# Altium schematic sheet Power.SchDoc
size C; Organization: MIT; SheetNumber: 3; SheetTotal: 5; Section: Power
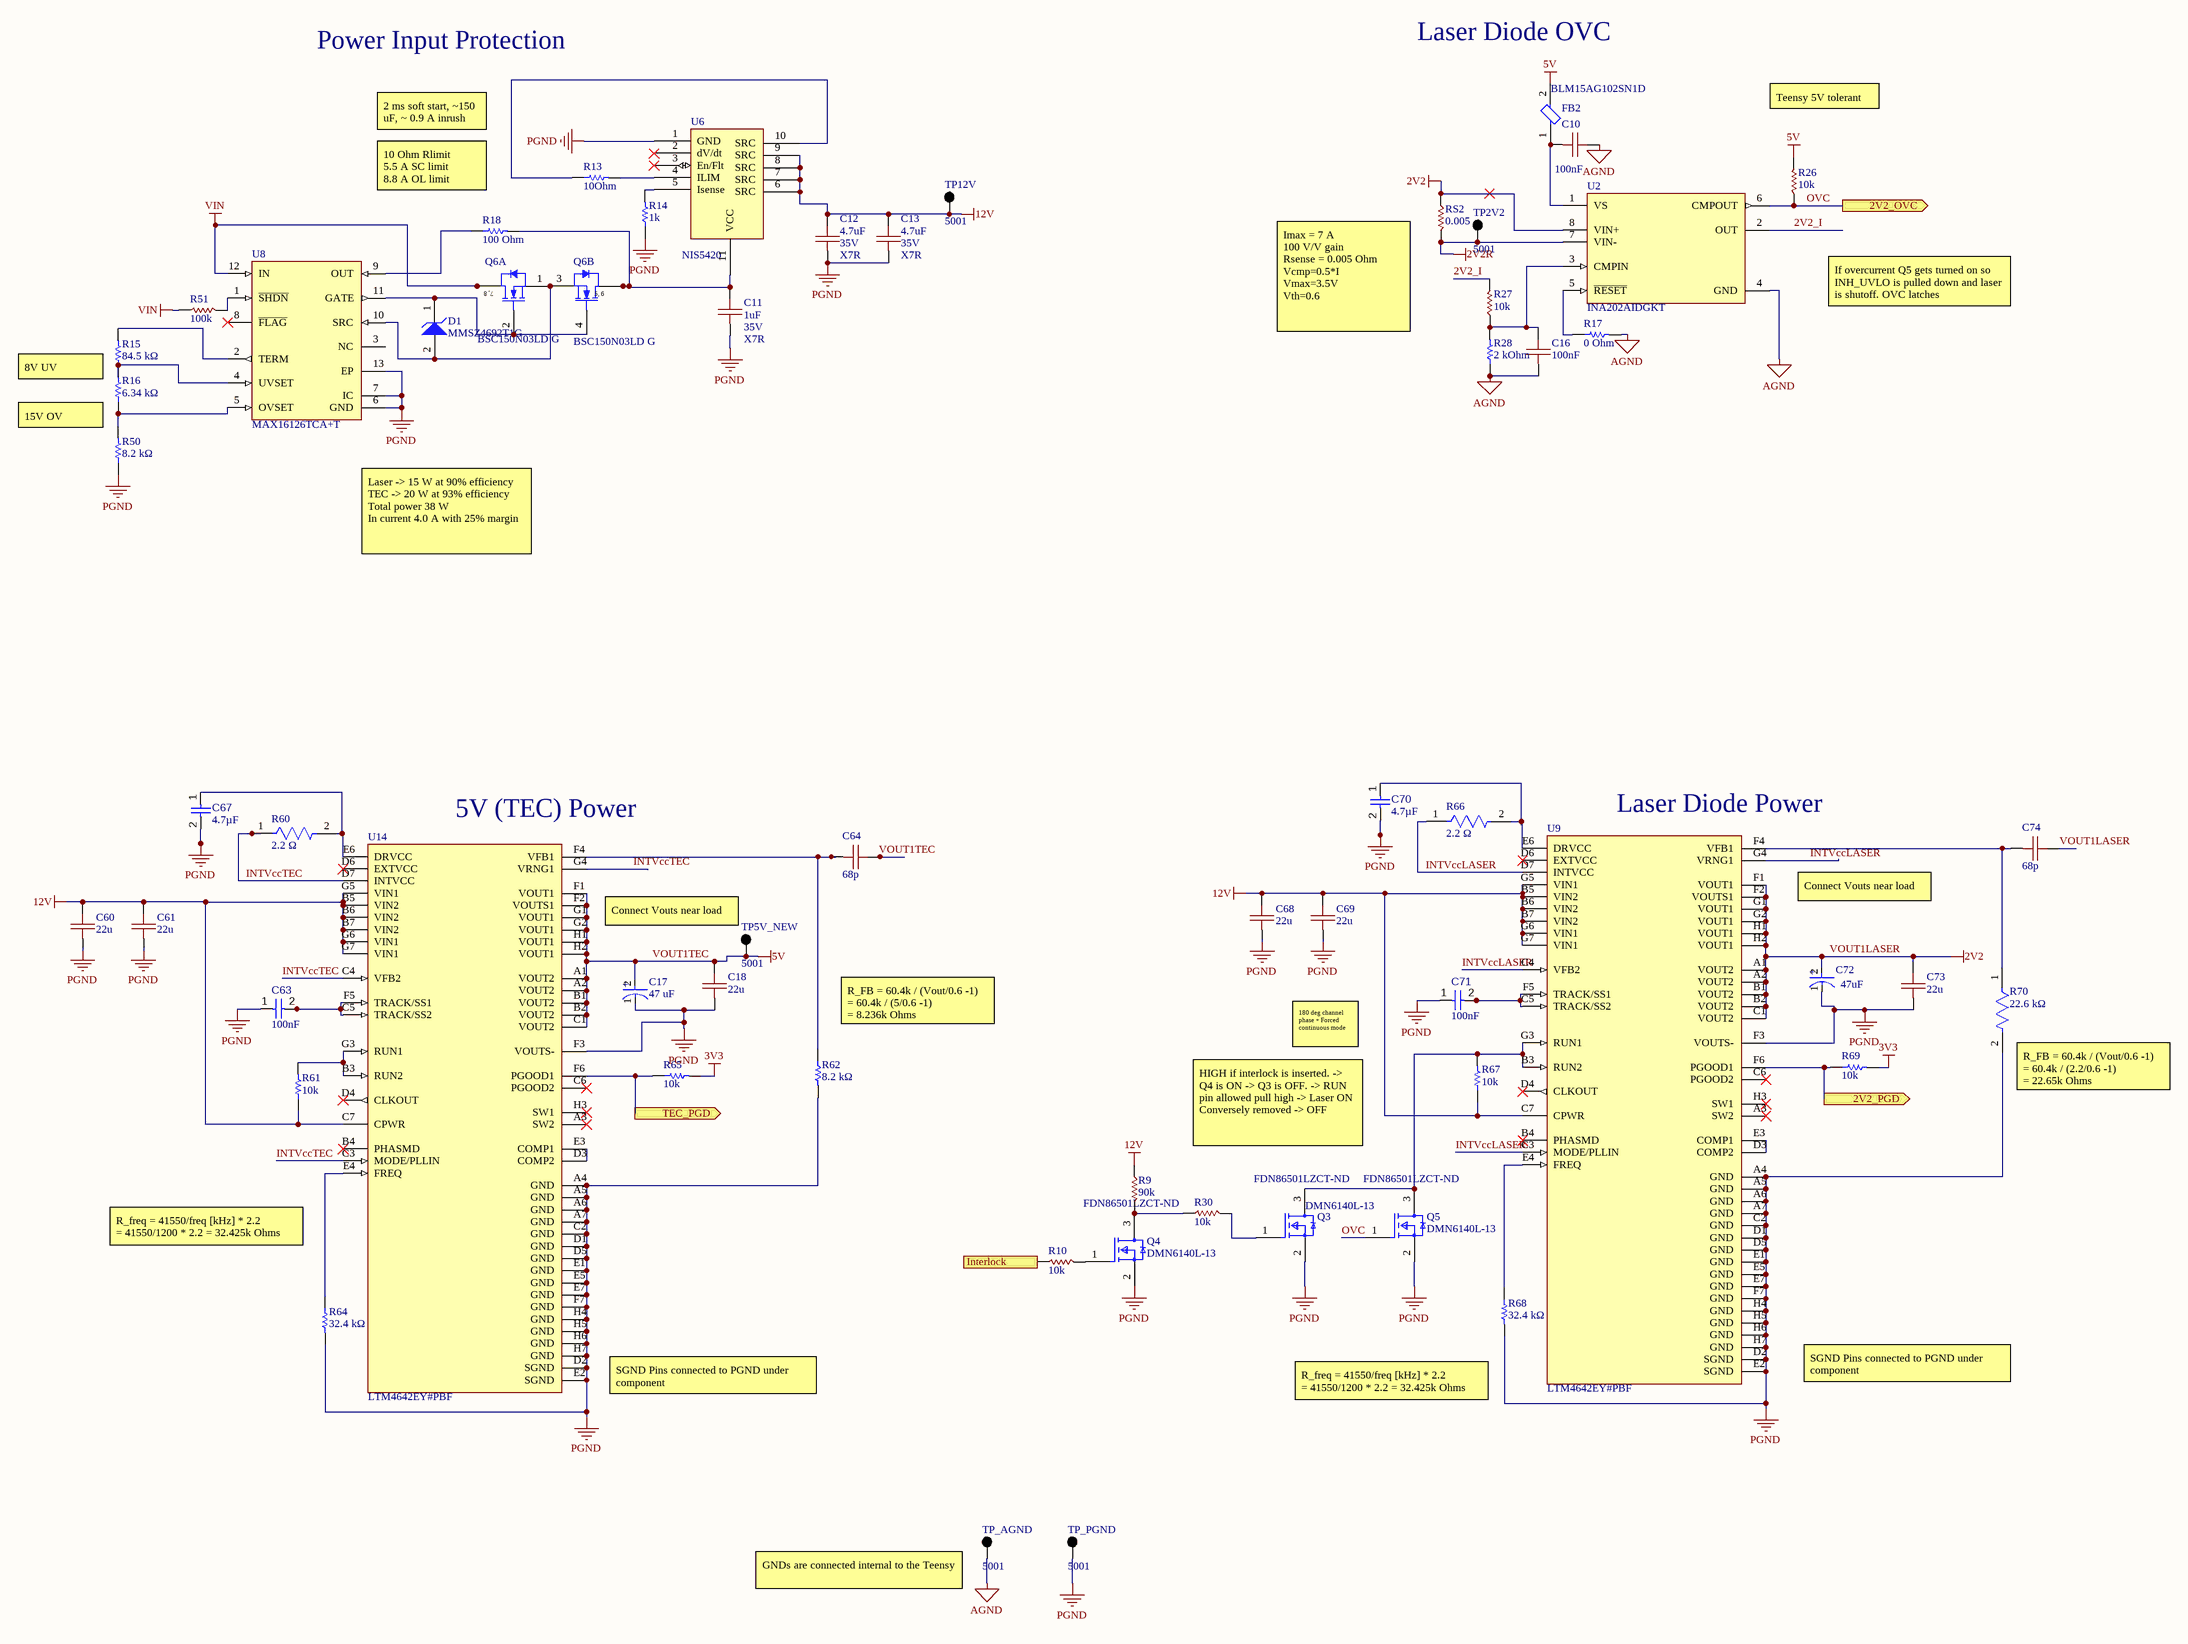
[diagram p0: Power.SchDoc]

## Parts
C10  100nF  [0603 B]
C11  1uF  Voltage: 35V  Type: X7R  [0805 B]
C12  4.7uF  Voltage: 35V  Type: X7R  [0805 B]
C13  4.7uF  Voltage: 35V  Type: X7R  [0805 B]
C16  100nF  [0603 B]
C17  47 uF  [FP-T491D476K025AT-MFG]
C18  22u  [1210]
C60  22u  [1210]
C61  22u  [1210]
C63  value 100nF  [CAPC1005X56X25LL10T15]  (hidden comment: Capacitor 0.1 uF +/- 5% 16 V 0402)
C64  68p  [0805 B]
C67  value 4.7µF  [CAPC0805(2012)145_L]  (hidden comment: Capacitor 4.7µF +/-40% 25V 0805)
C68  22u  [1210]
C69  22u  [1210]
C70  value 4.7µF  [CAPC0805(2012)145_L]  (hidden comment: Capacitor 4.7µF +/-40% 25V 0805)
C71  value 100nF  [CAPC1005X56X25LL10T15]  (hidden comment: Capacitor 0.1 uF +/- 5% 16 V 0402)
C72  Capacitance: 47uF  [FP-T491D476K025AT-MFG]  (hidden comment: 47 uF)
C73  22u  [1210]
C74  68p  [0805 B]
D1  MMSZ4692T1G  [ONSC-SOD-123-2-425-04_V]
FB2  BLM15AG102SN1D  [FP-BLM15-MFG]
Q3  DMN6140L-13  Supplier Part Number 2: FDN86501LZCT-ND  [FP-SOT23-MFG]
Q4  DMN6140L-13  Supplier Part Number 2: FDN86501LZCT-ND  [FP-SOT23-MFG]
Q5  DMN6140L-13  Supplier Part Number 2: FDN86501LZCT-ND  [FP-SOT23-MFG]
Q6  BSC150N03LD G  [INF-PG-TDSON-8-4_V]  (parts A,B of 2)
R9  90k  [0603]
R10  10k  [0603]
R13  10Ohm  [RESC1608X55X25NL10T15]
R14  1k  [RESC1608X55X30LL20T20]
R15  84.5 kΩ  [RESC1609X50X30NL10T20]
R16  6.34 kΩ  [RESC1608X55X30NL15T15]
R17  0 Ohm  [RESC1608X55X25ML10T15]
R18  100 Ohm  [RESC1608X55X30LL15T15]
R26  10k  [0603]
R27  10k  [0805]
R28  2 kOhm  [RESC1608X55X30ML15T15]
R30  10k  [0603]
R50  8.2 kΩ  [RESC1609X50X30NL10T20]
R51  100k  [0603]
R60  2.2 Ω  [FP-CRCW0603-HPe3-IPC_A]
R61  10k  [RESC1608X55X30LL20T20]
R62  8.2 kΩ  [RESC1609X50X30ML10T20]
R64  32.4 kΩ  [RESC1609X50X30LL10T20]
R65  10k  [RESC1608X55X30LL20T20]
R66  2.2 Ω  [FP-CRCW0603-HPe3-IPC_A]
R67  10k  [RESC1608X55X30LL20T20]
R68  32.4 kΩ  [RESC1609X50X30LL10T20]
R69  10k  [RESC1608X55X30LL20T20]
R70  22.6 kΩ  [FP-CRCW0402-e3-IPC_C]
RS2  0.005  [1206]
TP2V2  5001  [KSTN-5001]
TP5V_NEW  5001  [KSTN-5001]
TP12V  5001  [KSTN-5001]
TP_AGND  5001  [KSTN-5001]
TP_PGND  5001  [KSTN-5001]
U2  INA202AIDGKT  [FP-DGK0008A-IPC_A]
U6  NIS5420  [SON50P300X10_HS-11N]
U8  MAX16126TCA+T  [T1233+4_N]
U9  LTM4642EY#PBF  [FP-BGA-56-05-08-1961-MFG]
U14  LTM4642EY#PBF  [FP-BGA-56-05-08-1961-MFG]

## Ports
2V2_OVC (out), 2V2_PGD (out), Interlock (in), TEC_PGD (out)

## Nets
2V2R: RS2.1 TP2V2.1 U2.7(VIN-)
3V3: R65.2 R69.2
12V: C12.2 C13.2 C60.2 C61.2 C68.2 C69.2 R9.2 R61.1 R67.1 TP12V.1 U6.6(SRC) U6.7(SRC) U6.8(SRC) U6.9(SRC) U9.B5(VIN2) U9.B6(VIN2) U9.B7(VIN2) U9.C7(CPWR) U9.G5(VIN1) U9.G6(VIN1) U9.G7(VIN1) U14.B5(VIN2) U14.B6(VIN2) U14.B7(VIN2) U14.C7(CPWR) U14.G5(VIN1) U14.G6(VIN1) U14.G7(VIN1)
AGND: C10.2 C16.1 R17.2 R28.1 TP_AGND.1 U2.4(GND)
PGND: C11.1 C12.1 C13.1 C17.1(C) C18.1 C60.1 C61.1 C63.1 C67.2 C68.1 C69.1 C70.2 C71.1 C72.1(C) C73.1 Q3.2(S) Q4.2(S) Q5.2(S) R14.1 R50.1 R62.2 R64.2 R68.2 R70.2 TP_PGND.1 U6.1(GND) U8.6(GND) U8.7(IC) U8.13(EP) U9.A4(GND) U9.A5(GND) U9.A6(GND) U9.A7(GND) U9.C2(GND) U9.D1(GND) U9.D2(SGND) U9.D5(GND) U9.E1(GND) U9.E2(SGND) U9.E5(GND) U9.E7(GND) U9.F3(VOUTS-) U9.F7(GND) U9.H4(GND) U9.H5(GND) U9.H6(GND) U9.H7(GND) U14.A4(GND) U14.A5(GND) U14.A6(GND) U14.A7(GND) U14.C2(GND) U14.D1(GND) U14.D2(SGND) U14.D5(GND) U14.E1(GND) U14.E2(SGND) U14.E5(GND) U14.E7(GND) U14.F3(VOUTS-) U14.F7(GND) U14.H4(GND) U14.H5(GND) U14.H6(GND) U14.H7(GND)
VIN: Q6.7(D1) Q6.8(D1) R51.2 U8.12(IN)
VOUT1LASER: C72.2(A) C73.2 C74.2 RS2.2 U2.8(VIN+) U9.A1(VOUT2) U9.A2(VOUT2) U9.B1(VOUT2) U9.B2(VOUT2) U9.C1(VOUT2) U9.F1(VOUT1) U9.F2(VOUTS1) U9.G1(VOUT1) U9.G2(VOUT1) U9.H1(VOUT1) U9.H2(VOUT1)  [also labelled 2V2]
VOUT1TEC: C17.2(A) C18.2 C64.2 FB2.2 R26.1 TP5V_NEW.1 U14.A1(VOUT2) U14.A2(VOUT2) U14.B1(VOUT2) U14.B2(VOUT2) U14.C1(VOUT2) U14.F1(VOUT1) U14.F2(VOUTS1) U14.G1(VOUT1) U14.G2(VOUT1) U14.H1(VOUT1) U14.H2(VOUT1)  [also labelled 5V]
2V2_I: R27.1 U2.2(OUT)
2V2_PGD: R69.1 U9.F6(PGOOD1) ; port 2V2_PGD
Interlock: R10.2 ; port Interlock
INTVccLASER: R66.1 U9.C3(MODE/PLLIN) U9.C4(VFB2) U9.D7(INTVCC) U9.G4(VRNG1)
INTVccTEC: R60.1 U14.C3(MODE/PLLIN) U14.C4(VFB2) U14.D7(INTVCC) U14.G4(VRNG1)
OVC: Q5.1(G) R26.2 U2.6(CMPOUT) ; port 2V2_OVC
TEC_PGD: R65.1 U14.F6(PGOOD1) ; port TEC_PGD
NetC10_1: C10.1 FB2.1 U2.1(VS)
NetC11_2: C11.2 Q6.5(D2) Q6.6(D2) R18.2 U6.11(VCC)
NetC16_2: C16.2 R27.2 R28.2 U2.3(CMPIN)
NetC63_2: C63.2 U14.C5(TRACK/SS2) U14.F5(TRACK/SS1)
NetC64_1: C64.1 R62.1 U14.F4(VFB1)
NetC67_1: C67.1 R60.2 U14.E6(DRVCC)
NetC70_1: C70.1 R66.2 U9.E6(DRVCC)
NetC71_2: C71.2 U9.C5(TRACK/SS2) U9.F5(TRACK/SS1)
NetC74_1: C74.1 R70.1 U9.F4(VFB1)
NetD1_1: D1.1(K) Q6.2(G1) Q6.4(G2) U8.11(GATE)
NetD1_2: D1.2(A) Q6.1(S1) Q6.3(S2) U8.10(SRC)
NetQ3_1: Q3.1(G) R30.1
NetQ3_3: Q3.3(D) Q5.3(D) R67.2 U9.B3(RUN2) U9.G3(RUN1)
NetQ4_1: Q4.1(G) R10.1
NetQ4_3: Q4.3(D) R9.1 R30.2
NetR13_1: R13.1 U6.10(SRC)
NetR13_2: R13.2 U6.4(ILIM)
NetR14_2: R14.2 U6.5(Isense)
NetR15_1: R15.1 R16.2 U8.4(UVSET)
NetR15_2: R15.2 U8.2(TERM)
NetR16_1: R16.1 R50.2 U8.5(OVSET)
NetR17_1: R17.1 U2.5(~{RESET})
NetR18_1: R18.1 U8.9(OUT)
NetR51_1: R51.1 U8.1(~{SHDN})
NetR61_2: R61.2 U14.B3(RUN2) U14.G3(RUN1)
NetR64_1: R64.1 U14.E4(FREQ)
NetR68_1: R68.1 U9.E4(FREQ)
NetU9_D3: U9.D3(COMP2) U9.E3(COMP1)
NetU14_D3: U14.D3(COMP2) U14.E3(COMP1)

Not connected (* = marked no-connect by the designer): U6 2(dV/dt)* 3(En/Flt)*; U8 3(NC) 8(~{FLAG})*; U9 A3(SW2)* B4(PHASMD)* C6(PGOOD2)* D4(CLKOUT)* D6(EXTVCC)* H3(SW1)*; U14 A3(SW2)* B4(PHASMD)* C6(PGOOD2)* D4(CLKOUT)* D6(EXTVCC)* H3(SW1)*

## Notes on the sheet
- Power Input Protection
- Laser Diode OVC
- 2 ms soft start, ~150 uF, ~ 0.9 A inrush
- Teensy 5V tolerant
- (near R18) 10 Ohm Rlimit
  5.5 A SC limit
  8.8 A OL limit
- If overcurrent Q5 gets turned on so INH_UVLO is pulled down and laser is shutoff. OVC latches
- (near RS2) Imax = 7 A
  100 V/V gain
  Rsense = 0.005 Ohm
  Vcmp=0.5*I
  Vmax=3.5V
  Vth=0.6
- 15V OV
- 8V UV
- Laser -> 15 W at 90% efficiency
  TEC -> 20 W at 93% efficiency
  Total power 38 W
  In current 4.0 A with 25% margin
- (near U14) 5V (TEC) Power
- (near U9) Laser Diode Power
- Connect Vouts near load
- (near TP5V_NEW) Connect Vouts near load
- (near R62) R_FB = 60.4k / (Vout/0.6 -1)
  = 60.4k / (5/0.6 -1)
  = 8.236k Ohms
- 180 deg channel phase + Forced continuous mode
- (near R70) R_FB = 60.4k / (Vout/0.6 -1)
  = 60.4k / (2.2/0.6 -1)
  = 22.65k Ohms
- HIGH if interlock is inserted. -> Q4 is ON -> Q3 is OFF. -> RUN pin allowed pull high -> Laser ON
  Conversely removed -> OFF
- R_freq = 41550/freq [kHz] * 2.2
  = 41550/1200 * 2.2 = 32.425k Ohms
- (near U14) SGND Pins connected to PGND under component
- SGND Pins connected to PGND under component
- (near TP_AGND) GNDs are connected internal to the Teensy
- Title
- Size
- Date
- File
- C
- Section
- Time
- Sheet
- of
- Revision
- Drawn
- 33-207 / 77 Mass. Ave.
- Cambridge, MA 02139
- (in symbol CMP-1090-00073-1, part A) 7, 8
- (in symbol CMP-1090-00073-1, part B) 5, 6
- (in symbol CMP-03017-000020-1) +

## Library data of the parts
C10 C16 = CAP 0603: 603 Capacitor; Value: 100nF
C11-C13 C64 C74 = CAP 0805: 805 Capacitor
  C11: Value: 1uF
  C12 C13: Value: 4.7uF
  C64 C74: Value: 68p
C17 C72 = CMP-03017-000020-1: CAP TANT 47UF 10% 25V 2917; Manufacturer: KEMET; Manufacturer Part Number: T491D476K025AT; Dielectric Material: Tantalum; Life (Hours): 2000Hour; Ripple Current: 463mA; Leakage Current: 11.8uA; Polarity: Polar; ESR (Equivalent Series Resistance): 700mR; Height - Seated (Max): 0.122inch; Package Quantity: 1; Max Operating Temperature: 125°C; Failure Rate: 0.001%; Height: 2.8mm; Voltage Rating (DC): 25V; Dissipation Factor: 10%; Mount: Surface Mount; Min Operating Temperature: -55°C; Packaging: Tape and Reel; Radiation Hardening: No; Case Code (Metric): 7343; Features: General Purpose; Voltage: 25V; Case/Package: 2917; Case Code (Imperial): 2917; Tolerance: 10%; Number of Pins: 2; Weight: 0.023634oz; REACH SVHC: No SVHC; RoHS Compliant: Yes; Length: 7.3mm; Depth: 4.3mm; Lead Free: Lead Free; Width: 4.3mm; Voltage Rating: 25V; Termination: SMD/SMT; Supplier 1: Digi-Key; Supplier Part Number 1: 399-8391-1-ND; RoHS: Yes; Category: Tantalum Capacitors; Stock 1: 66410; Pricing 1: 1=1.63000, 10=1.29000, 50=1.11840, 100=0.96780 (USD); Construction: Flat; Series: T491; Size: 2.8mm; Reach SVHC Compliant: Yes; ComponentLink1URL: https://datasheet.ciiva.com/5934/1776112-5934658.pdf?src-supplier=Farnell; ComponentLink1Description: https://datasheet.ciiva.com/5934/1776112-5934658.pdf?src-supplier=Farnell; ComponentLink2URL: https://datasheet.ciiva.com/27052/1574532-27052600.pdf?src-supplier=Jameco; ComponentLink2Description: https://datasheet.ciiva.com/27052/1574532-27052600.pdf?src-supplier=Jameco; ComponentLink3URL: https://datasheet.ciiva.com/8079/kem-t2005-t491-8079804.pdf?src-supplier=Element14; ComponentLink3Description: https://datasheet.ciiva.com/8079/kem-t2005-t491-8079804.pdf?src-supplier=Element14; ComponentLink4URL: https://datasheet.ciiva.com/7758/1776112-7758986.pdf?src-supplier=Element14; ComponentLink4Description: https://datasheet.ciiva.com/7758/1776112-7758986.pdf?src-supplier=Element14; ComponentLink5URL: https://datasheet.ciiva.com/7758/1776112-7758987.pdf?src-supplier=Element14; ComponentLink5Description: https://datasheet.ciiva.com/7758/1776112-7758987.pdf?src-supplier=Element14; ComponentLink6URL: https://datasheet.ciiva.com/7758/1446014-7758989.pdf?src-supplier=Element14; ComponentLink6Description: https://datasheet.ciiva.com/7758/1446014-7758989.pdf?src-supplier=Element14; ComponentLink7URL: https://datasheet.ciiva.com/22698/1854511-22698959.pdf?src-supplier=Element14; ComponentLink7Description: https://datasheet.ciiva.com/22698/1854511-22698959.pdf?src-supplier=Element14; ComponentLink8URL: https://datasheet.ciiva.com/7758/1698764-7758988.pdf?src-supplier=Element14; ComponentLink8Description: https://datasheet.ciiva.com/7758/1698764-7758988.pdf?src-supplier=Element14; ComponentLink9URL: https://datasheet.ciiva.com/6246/kem-t2005-t491-6246794.pdf?src-supplier=Digi-Key; ComponentLink9Description: https://datasheet.ciiva.com/6246/kem-t2005-t491-6246794.pdf?src-supplier=Digi-Key; ComponentLink10URL: https://datasheet.ciiva.com/6246/kem-t2005-t491-6246791.pdf?src-supplier=Digi-Key; ComponentLink10Description: https://datasheet.ciiva.com/6246/kem-t2005-t491-6246791.pdf?src-supplier=Digi-Key; ComponentLink11URL: https://datasheet.ciiva.com/6246/kem-t2005-t491-6246799.pdf?src-supplier=Digi-Key; ComponentLink11Description: https://datasheet.ciiva.com/6246/kem-t2005-t491-6246799.pdf?src-supplier=Digi-Key; ComponentLink12URL: https://datasheet.ciiva.com/18094/getdatasheetpartid-44077-18094583.pdf?src-supplier=Verical; ComponentLink12Description: https://datasheet.ciiva.com/18094/getdatasheetpartid-44077-18094583.pdf?src-supplier=Verical
  C17: Capacitance: 47uF
C18 C60 C61 C68 C69 C73 = CAP 1210: 1210 Capacitor; Value: 22u
C63 C71 = CMP-001-00001-6: Chip Capacitor, 0.1 uF, +/- 5%, 16 V, 0402 (1005 Metric); Capacitor Type: Ceramic; Voltage Rating: 16V; Max Operating Temperature: 125°C; Min Operating Temperature: -55°C; Case/Package: 0402; Mounting Technology: SM; Pins: 2; Tolerance: 5%; RoHS Compliant: True
C67 C70 = CMP-001-00080-4: Chip Capacitor, 4.7µF +/-40%, 25V, 0805, Thickness 1.45 mm; Tolerance: 20%; Voltage Rating: 25V; Min Operating Temperature: -55°C; Max Operating Temperature: 85°C; Pins: 2; Mounting Technology: SMT; Case/Package: 0805
D1 = CMP-1060-00434-1: Zener Voltage Regulator, 500 mW, 2-Pin SOD-123, Pb-Free, Tape and Reel; Manufacturer: On Semiconductor; VZ Typ (V): 6.8; P Max (W): 0.5; ComponentLink2URL: http://www.onsemi.com/pub_link/Collateral/MMSZ4678T1-D.PDF; Mounting Technology: Surface Mount; DatasheetVersion: Rev. 9; ComponentLink1Description: Manufacturer URL; ComponentLink3URL: http://www.onsemi.com/pub_link/Collateral/425-04.PDF; PackageReference: SOD-123-2-425-04; ComponentLink2Description: Datasheet; RoHS: Pb-Free; Packing: Tape and Reel; ComponentLink1URL: http://www.onsemi.com/; PackageDescription: 2-Pin SOD, Body 1.6 x 2.69 mm; ComponentLink3Description: Package Specification; PartNumber: MMSZ4692T1G; PackageVersion: Rev. G, 10/2009; Supplier 1: Digi-Key; Supplier Part Number 1: MMSZ4692T1GOSCT-ND
FB2 = CMP-0686-00181-4: FERRITE BEAD 1 KOHM 0402 1LN; Manufacturer: Murata; 3DS Part Number: 310-00007; Impedance At Frequency: 1kΩ @ 100MHz; Tolerance: 25%; Series Resistance: 650mΩ; Test Frequency: 100MHz; Rms Current: 300mA; Manufacturer Part Number: BLM15AG102SN1D; Octopart: https://octopart.com/blm15ag102sn1d-murata-368316; RoHS: TRUE; Ipc Land Pattern Name: CAPC10050X50; Temperature Range High: +125°C; ComponentLink2Description: Datasheet; Device Class L1: Passive Components; Package: BLM15; Temperature Range Low: -55°C; Core Material: Ferrite; ComponentLink2URL: https://www.murata.com/en-us/products/productdata/8796740059166/ENFA0018.pdf?1514431813000; Mouser Description: Ferrite Beads 1K OHM HIGH SPEED SI; Digikey Description: FERRITE BEAD 1 KOHM 0402 1LN; Temperature: -55°C to +125°C; Category: FBead; Device Class L3: Ferrite Beads and Chips; Device Class L2: EMI / RFI Components; Automotive: No; Height: 0.55mm; Lead Free: Yes
Q3-Q5 = CMP-12801-000047-1: MOSFET N-CH 60V 1.6A SOT23; Manufacturer: Diodes Inc.; Turn Off Delay Time: 16.3ns; Power Dissipation: 0.7W; Pulse Drain Current: 10A; Number Of Channels: 1; Reverse Recovery Time: 16.8ns; Typ Forward Diode Voltage: 0.75V; Gate To Source Voltage: 20V; Rthja Max: 183°C/W; Gate Charge At Vgs: 8.6nC @ 10V; Drain To Source Resistance: 92mΩ; Depletion Mode: False; Max Junction Temp: +150°C; Max Forward Diode Voltage: 1V; Reverse Recovery Charge: 9nC; Input Capacitace At Vds: 315pF @ 40V; Standoff Height: 0.013mm; Threshold Vgs Max: 3V; Turn On Delay Time: 2.6ns; Mouser Description: MOSFET 31V to 99V N-Ch FET 60Vds 20Vgs 2.3A; ComponentLink2Description: Datasheet; Digikey Description: MOSFET N-CH 60V 1.6A SOT23; Lead Free: Yes; Category: Trans; Device Class L3: MOSFETs; Temperature Range High: +150°C; Octopart: https://octopart.com/dmn6140l-13-diodes+inc.-38898616; Drain To Source Voltage: 60V; ComponentLink2URL: https://www.diodes.com/assets/Datasheets/DMN6140L.pdf; Drain To Source Breakdown Voltage: 60V; Footprint Url: https://www.diodes.com/assets/Package-Files/SOT23.pdf; Package: SOT23; Continuous Drain Current: 1.6A; Device Class L1: Discrete Semiconductors; Device Class L2: Transistors; Number Of N Channels: 1; Temperature Range Low: -55°C; Height: 1.1mm; Manufacturer Part Number: DMN6140L-13; RoHS: TRUE; Temperature: -55°C to +150°C; Threshold Vgs Min: 1V; Automotive: No; Supplier 1: Digi-Key; Supplier 2: Digi-Key
Q6 = CMP-1090-00073-1: N-Channel OptiMOS 3 Power-Transistor, 30 V VDS, 20 A ID, -55 to 150 degC, PG-TDSON-8-4, Reel, Green; Manufacturer: Infineon; ID (max): 20Â A; RthJC (max): 4.9Â K/W; Polarity: N; RDS (on) (max) (@4.5V): 22Â mOhm; RthJA (max): 35 K/W; RDS (on) (max): 15Â mOhm; VDS (max): 30Â V; Ptot (max): 26Â W; VGS(th) (max): 2.2Â V; VGS(th) (min): 1Â V; QG: 4.8Â nC; Green: TRUE; IDpuls (max): 80Â A; ComponentLink2Description: Datasheet; DatasheetVersion: Rev. 1.4; Halogen-free: TRUE; ComponentLink1Description: Manufacturer URL; Mounting Technology: Surface Mount; ComponentLink3Description: Package Specification; ComponentLink3URL: http://www.infineon.com/cms/packages/SMD_-_Surface_Mounted_Devices/P-PG-TDSON/P-PG-TDSON-08-04.html?__locale=en; PackageReference: PG-TDSON-8-4; PackageDescription: 8-Pin Plastic (Green) Thin Dual Small Outline Non-Leaded Package, 5.15 x 5.9 mm Body, 1.27 mm Pitch; Rth: 4.9Â K/W; ComponentLink2URL: http://www.infineon.com/dgdl/BSC150N03LD_rev1.4.pdf?folderId=db3a304313b8b5a60113cee8ed2a02db&fileId=db3a304316f66ee80116fb504a5d729f; PartNumber: BSC150N03LD G; Packing: Reel; PackageVersion: Rev. 03; ComponentLink1URL: http://www.infineon.com/
R9 R10 R26 R30 R51 = RES 0603: 603 Resistor
  R9: Value: 90k
  R10 R26 R30: Value: 10k
  R51: Value: 100k
R13 = CMP-1659-00008-4: Chip Resistor, 10 Ohm, +/- 1%, 0.1 W, -55 to 155 degC, 0603 (1608 Metric), RoHS, Tape and Reel; Manufacturer: Yageo; Voltage Rating: 50 V; PackageReference: 0603; ComponentLink3Description: Package Specification; Packaging: Tape and Reel; Max Operating Temperature: 155 degC; ComponentLink3URL: http://www.farnell.com/datasheets/443971.pdf; PackageDescription: 2-Pin Surface Mount Device, Body 1.6 x 0.8 mm; ComponentLink1URL: http://www.yageo.com/; Pins: 2; REACH SVHC: No SVHC; RoHSCompliant: true; ComponentLink2URL: http://www.yageo.com/documents/recent/PYu-RC_Group_51_RoHS_L_04.pdf; DatasheetVersion: Rev. 4, 02/2016; Mount: Surface Mount; Package Quantity: 200; Min Operating Temperature: -55 degC; Height: 0.45 mm; Mounting Technology: Surface Mount; ComponentLink1Description: Manufacturer URL; ComponentLink2Description: Datasheet; Length: 1.6 mm
R14 R61 R65 R67 R69 = CMP-2000-00873-1: Manufacturer: Panasonic; Part Number: ERA3AEB102V
R15 = CMP-2000-03611-1: Manufacturer: Vishay Dale; Part Number: CRCW060384K5FKEA
R16 = CMP-2000-00600-1: Part Number: ERJ-3EKF6341V; Manufacturer: Panasonic
R17 = CMP-2100-03667-1: Chip Resistor, 0 Ohm, +/- 5%, 0.1 W, -55 to 155 degC, 0603 (1608 Metric), RoHS, Tape and Reel; Manufacturer: Yageo; Temperature Coefficient: 200ppm/degreesC; Voltage Rating: 50V; Power Rating: 100mW; Resistance: 0mOhm; Width: 0.8mm; Max Operating Temperature: 155degC; Tolerance: 5%; Package Reference: 0603; Height: 0.45mm; Depth: 0.8mm; Package Description: 2-Pin Surface Mount Device, Body 1.6 x 0.8 mm; Termination: SMD/SMT; Package Quantity: 5000; Case/Package: 0603; Case Code (Imperial): 0603; Radiation Hardening: No; Number of Pins: 2; Length: 1.6mm; Lead Free: LeadFree; Voltage Rating (DC): 50V; Military Standard: Not; Datasheet URL: http://www.yageo.com/NewPortal/yageodocoutput?fileName=/pdf/R-Chip/PYu-RC_Group_51_RoHS_L_5.pdf; Manufacturer URL: http://www.yageo.com/; Packaging: TapeandReel; Case Code (Metric): 1608; Min Operating Temperature: -55degC; Composition: ThickFilm; RoHSCompliant: true; Contact Plating: Tin; Datasheet Version: Rev. 5, 10/2016; REACH SVHC: NoSVHC
R18 = CMP-2000-00179-1: Manufacturer: Panasonic; Part Number: ERJ-3EKF1000V
R27 = RES 0805: 805 Resistor; Value: 10k
R28 = CMP-2000-00317-1: Part Number: ERJ-3EKF2001V; Manufacturer: Panasonic
R50 R62 = CMP-2000-03620-1: Part Number: CRCW06038K20FKEA; Manufacturer: Vishay Dale
R60 R66 = CMP-02407-007534-1: RES Thick Film, 2.2Ω, 1%, 0.33W, 100ppm/°C, 0603; Power Rating: 250mW; Resistance: 2.2R; Composition: Thick Film; Packaging: Tape and Reel; Case/Package: 0603; Number of Terminations: 2; Max Power Dissipation: 250mW; Max Operating Temperature: 155°C; Tolerance: 1%; Termination: Solder; Lead Free: Lead Free; Length: 1.6mm; Contact Plating: Tin; Case Code (Imperial): 0603; Package Quantity: 5000; Min Operating Temperature: -55°C; Height: 0.022inch; Features: Automotive AEC-Q200; Temperature Coefficient: 100ppm/°C; Case Code (Metric): 1608; Width: 0.033inch; Radiation Hardening: No; Depth: 0.85mm; Mount: Surface Mount
R64 R68 = CMP-2000-03236-1: Manufacturer: Vishay Dale; Part Number: CRCW060332K4FKEA
R70 = CMP-1011-00661-5: RES Thick Film, 22.6kΩ, 1%, 0.063W, 100ppm/°C, 0402; Resistance: 22.6kR; Power Rating: 63mW; Voltage Rating: 50V; Max Operating Temperature: 155°C; Contact Plating: Tin; Case/Package: 0402; Number of Terminations: 2; Radiation Hardening: No; Min Operating Temperature: -55°C; Features: Automotive AEC-Q200; Packaging: Tape and Reel; Weight: 2.3E-05oz; Number of Pins: 2; Composition: Thick Film; Temperature Coefficient: 100ppm/°C; Package Quantity: 10; Case Code (Metric): 1005; Case Code (Imperial): 0402; Military Standard: Not; Termination: SMD/SMT; Max Power Dissipation: 63mW; Height: 0.35mm; Depth: 0.5mm; Width: 0.02inch; Tolerance: 1%; Length: 1mm
RS2 = RES 1206: 1206 Resistor; Value: 0.005; Supplier 1: Digi-Key; Supplier Part Number 1: P.010AUCT-ND
TP2V2 TP5V_NEW TP12V TP_AGND TP_PGND = CMP-2000-05181-1: Test Point, Black, 1-Pin THD, RoHS, Bulk; Manufacturer: Keystone; Other Names: 5001K; Catalog Drawings: 5000Series; Alternate Color: 5004K-ND / -TESTPOINTPCMINI.040"DYELLOW / 5003K-ND / -TESTPOINTPCMINI.040"DORANGE / 5002K-ND / -TESTPOINTPCMINI.040"DWHITE / 5000K-ND / -TESTPOINTPCMINI.040"DRED; Kits: DKTGRS232C-KIT-ND / -TTLCONVERTER; Online Catalog: ColorCodedTestPoints; Datasheet URL: https://ciiva.com/datasheet-click-2917627?src=ciiva&sig=bd195616; Mounting Type: 0.040"(1.02mm)HoleDiameter; Family: TestPoints; RoHS Information: RoHSComplianceStatement; Datasheet Version: Rev. G, 12/2008; Color: Black; Category: TestandMeasurement; Standard Package: 100; Manufacturer URL: http://www.keyelco.com/; Material: Base,Nylon46,UL94V-0; Type: PCTestPoint,Miniature; Terminal: 0.010"x0.020"(0.25mmx0.51mm)PhosphorBronzeWire,SilverPlated; Series: THM; Packaging: Bulk
U2 = CMP-04896-000066-1: IC CURRENT MONITOR 3.5% 8VSSOP; Min Supply Voltage: 2.7V; Operating Supply Current: 1.85mA; Bandwidth: 300kHz; Max Supply Voltage: 18V; Mount: Surface Mount; Weight: 0.000935oz; Number of Pins: 8; Packaging: Tape and Reel; Lead Free: Lead Free; Accuracy: 3.5%; Package Quantity: 1; Radiation Hardening: No; Case/Package: VSSOP; Series: -; Max Operating Temperature: 125°C; Min Operating Temperature: -40°C; RoHS Compliant: Yes
U8 = CMP-0251-00243-1: Load-Dump/Reverse-Voltage Protection Circuit, switch-mode fault management, 12-Pin TQFN-EP, -40°C to +125°C, Pb-Free, Tape and Reel; ComponentLink1URL: http://www.maxim-ic.com; PackageReference: T1233+4; ComponentLink2URL: http://datasheets.maxim-ic.com/en/ds/MAX16126-MAX16127.pdf; ComponentLink2Description: Datasheet; PackageVersion: revJ, 2010; ComponentLink1Description: Manufacturer URL; DatasheetVersion: Rev 0, Nov-2011; ComponentLink3URL: http://pdfserv.maxim-ic.com/package_dwgs/21-0136.PDF; ComponentLink3Description: Package Specification; PackageDescription: 12-Pin Thin Quad Flatpack, No Leads, 3 x 3 x 0.75 mm Body, 0.5 mm Pitch, TQFN, Pb-Free; Code_JEDEC: MO-220WEED-1
U9 U14 = CMP-09139-000068-1: DC DC CNVRTR 0.6-5.5V 0.6-5.5V; Min Input Voltage: 4.5V; Current - Output 2: 4A; Voltage - Output 1: 5.5V; Number of Outputs: 2; Switching Frequency: 1.4MHz; Max Input Voltage: 20V; Min Operating Temperature: -40°C; Features: UVLO; Height: 0.19inch; RoHS Compliant: Yes; REACH SVHC: No SVHC; Width: 0.35inch; Current - Output 1: 4A; Mount: Surface Mount; Max Operating Temperature: 125°C; Packaging: Tray; Length: 0.44inch; Case/Package: BGA; Voltage - Output 2: 5.5V; Number of Pins: 56; Max Output Current: 4A